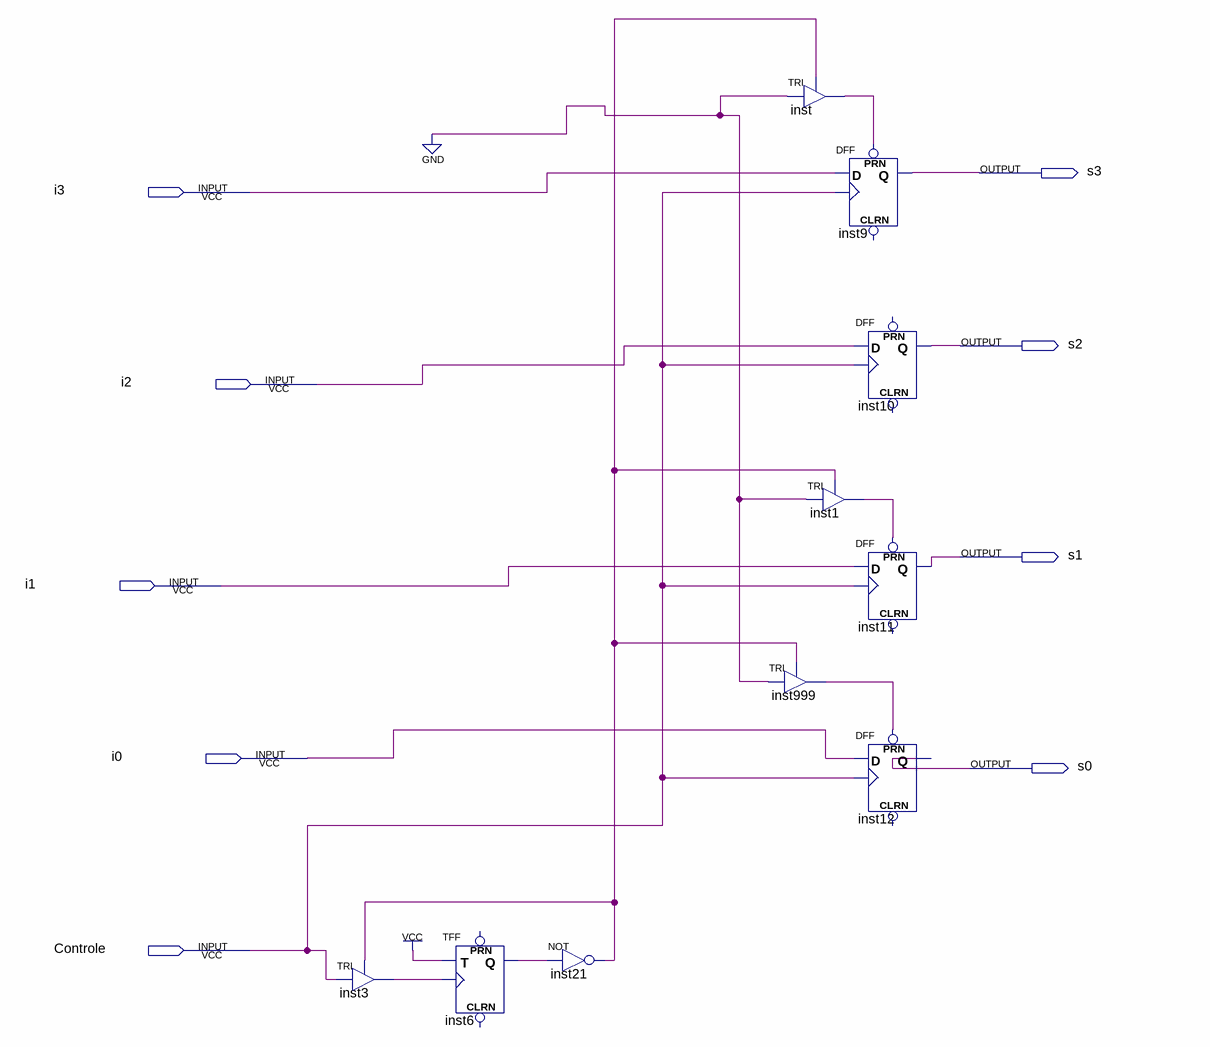
[diagram p0: schematic sheet]
// Quartus schematic Memoria4bitsDIGspace1011.bdf as structural Verilog: 10 symbols, 9 pins
module Memoria4bitsDIGspace1011 (
  input  i3,
  input  i2,
  input  i1,
  input  i0,
  input  Controle,
  output s3,
  output s2,
  output s1,
  output s0
);

  wire inst1_out, inst3_out, inst6_q, inst21_out, inst999_out, inst_out;

  TRI inst3 (.IN(Controle), .OE(inst21_out), .OUT(inst3_out));
  TFF inst6 (.T(1'b1), .CLK(inst3_out), .Q(inst6_q));  // open: PRN, CLRN
  not inst21 (inst21_out, inst6_q);
  TRI inst999 (.IN(1'b0), .OE(inst21_out), .OUT(inst999_out));
  TRI inst (.IN(1'b0), .OE(inst21_out), .OUT(inst_out));
  DFF inst9 (.CLK(Controle), .D(i3), .PRN(inst_out), .Q(s3));  // open: CLRN
  DFF inst10 (.CLK(Controle), .D(i2), .Q(s2));  // open: CLRN, PRN
  TRI inst1 (.IN(1'b0), .OE(inst21_out), .OUT(inst1_out));
  DFF inst11 (.CLK(Controle), .D(i1), .PRN(inst1_out), .Q(s1));  // open: CLRN
  DFF inst12 (.CLK(Controle), .D(i0), .PRN(inst999_out), .Q(s0));  // open: CLRN
endmodule
